# Altium schematic sheet bikelight.SchDoc
size 209 x 148 mm; DocumentNumber: 1; SheetNumber: 1; SheetTotal: 1
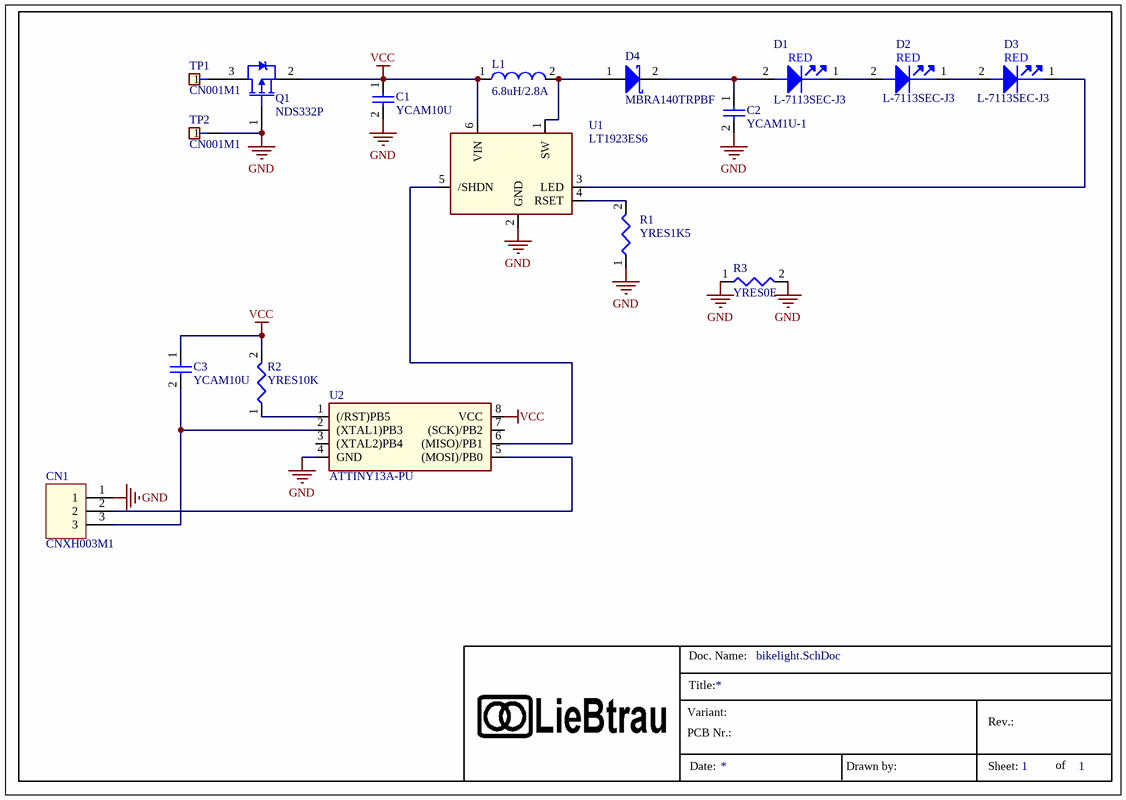
[diagram p0: bikelight.SchDoc]

## Parts
C1  YCAM10U  [CA_1206]
C2  YCAM1U-1  [CA_0805]
C3  YCAM10U  [CA_1206]
CN1  CNXH003M1  [CN_B3B-XH-A]
D1  L-7113SEC-J3  [DI_LED_5MM]
D2  L-7113SEC-J3  [DI_LED_5MM]
D3  L-7113SEC-J3  [DI_LED_5MM]
D4  MBRA140TRPBF  [DI_DO-214AC]
L1  6.8uH/2.8A  [CL_VISHAY_IHLP-2525CZ-01]
Q1  NDS332P  [SC_SOT23]
R1  YRES1K5  [RE_1206]
R2  YRES10K  [RE_1206]
R3  YRES0E  [RE_1206]
TP1  CN001M1  [CN_TP_TH_1.3mm]  (no BOM)
TP2  CN001M1  [CN_TP_TH_1.3mm]  (no BOM)
U1  LT1923ES6  [SC_SOT23-6]
U2  ATTINY13A-PU  [SC_PDIP8]

## Nets
GND: C1.2 C2.2 CN1.1 Q1.1(G) R1.1 R3.1 R3.2 TP2.1 U1.2(GND) U2.4(GND)
VCC: C1.1 C3.1 L1.1 Q1.2(S) R2.2 U1.6(VIN) U2.8(VCC)
NetC2_1: C2.1 D1.2(C) D4.2(K)
NetC3_2: C3.2 CN1.3 U2.2((XTAL1)PB3)
NetCN1_2: CN1.2 U2.5((MOSI)/PB0)
NetD1_1: D1.1(A) D2.2(C)
NetD2_1: D2.1(A) D3.2(C)
NetD3_1: D3.1(A) U1.3(LED)
NetD4_1: D4.1(A) L1.2 U1.1(SW)
NetQ1_3: Q1.3(D) TP1.1
NetR1_2: R1.2 U1.4(RSET)
NetR2_1: R2.1 U2.1((/RST)PB5)
NetU1_5: U1.5(/SHDN) U2.6((MISO)/PB1)

Not connected (* = marked no-connect by the designer): U2 3((XTAL2)PB4) 7((SCK)/PB2)

## Notes on the sheet
- Title:
- Doc. Name:
- Variant:
- PCB Nr.:
- Rev.:
- Date:
- Drawn by:
- Sheet:
- of
- (in symbol L-7113SEC-J3) RED

## Library data of the parts
C1 C3 = YCAM10U: Order Code: Farnell 1828807; Part Number: YCAM10U; Component Type: capacitor
C2 = YCAM1U-1: Manufacturer: Murata; Order Code: Farnell 9527710; Part Number: YCAM1U-1; Component Type: capacitor
CN1 = CNXH003M1: Manufacturer: JST; Order Code: Farnell 1516277; Part Number: CNXH003M1; Component Type: connector
D1-D3 = L-7113SEC-J3: Manufacturer: Kingbright; Order Code: Farnell 2080005; Part Number: L-7113SEC-J3; Component Type: led
D4 = MBRA140TRPBF: Manufacturer: Vishay; Order Code: Farnell 1651133; Part Number: MBRA140TRPBF; Component Type: diode
L1 = LQH6PPN6R8M43L: Manufacturer: Murata; Order Code: Farnell 1782808; Part Number: LQH6PPN6R8M43L; Component Type: inductor
Q1 = NDS332P: Manufacturer: Fairchild Semiconductor; Order Code: Farnell 9846379; Part Number: NDS332P; Component Type: transistor
R1 = YRES1K5: Resistor; Manufacturer: Panasonic; Order Code: Farnell 1751078; Part Number: YRES1K5; Component Type: resistor
R2 = YRES10K: Resistor; Manufacturer: Vishay Draloric; Order Code: Farnell 1469970; Part Number: YRES10K; Component Type: resistor
R3 = YRES0E: Resistor; Manufacturer: Vishay Draloric; Order Code: Farnell 1469963; Part Number: YRES0E; Component Type: resistor
U1 = LT1932ES6: Manufacturer: Linear Technology; Order Code: Farnell 1663808; Part Number: LT1932ES6; Component Type: power
U2 = ATTINY13A-PU: Manufacturer: Atmel; Order Code: Farnell 1704566; Part Number: ATTINY13A-PU; Component Type: microcontroller
TP1 TP2 = CN001M1: Part Number: CN001M1; Component Type: testpin